# Altium schematic sheet PCA_0006_Mini_CB_80Pin_REV_B.SchDoc
size A4; DrawnBy: Philip Rowse
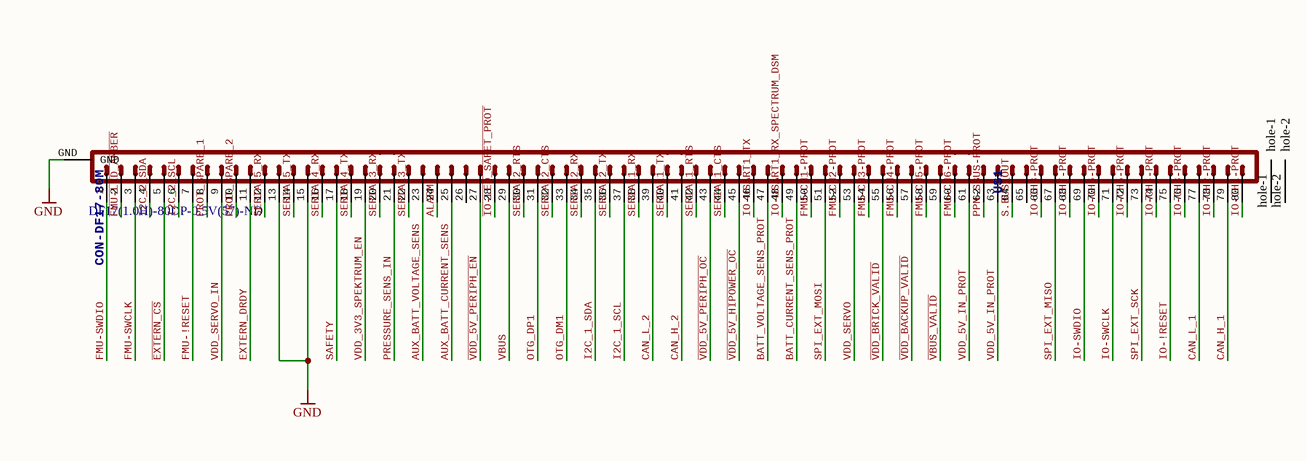
[diagram p0: PCA_0006_Mini_CB_80Pin_REV_B.SchDoc]

## Parts
U$1  CON-DF17-80M  Supplier Part Number 1: DF17(1.0H)-80DP-0.5V(57)-ND  [CON-DF17-80M]

## Nets
GND: U$1.13 U$1.15 U$1.GND
ALARM: U$1.24
AUX_BATT_CURRENT_SENS: U$1.25
AUX_BATT_VOLTAGE_SENS: U$1.23
BATT_CURRENT_SENS_PROT: U$1.49
BATT_VOLTAGE_SENS_PROT: U$1.47
CAN_H_1: U$1.79
CAN_H_2: U$1.41
CAN_L_1: U$1.77
CAN_L_2: U$1.39
~{EXTERN_CS}: U$1.5
EXTERN_DRDY: U$1.11
~{FMU-LED_AMBER}: U$1.2
FMU-!RESET: U$1.7
FMU-CH1-PROT: U$1.50
FMU-CH2-PROT: U$1.52
FMU-CH3-PROT: U$1.54
FMU-CH4-PROT: U$1.56
FMU-CH5-PROT: U$1.58
FMU-CH6-PROT: U$1.60
FMU-SWCLK: U$1.3
FMU-SWDIO: U$1.1
I2C_1_SCL: U$1.37
I2C_1_SDA: U$1.35
I2C_2_SCL: U$1.6
I2C_2_SDA: U$1.4
~{IO-LED_SAFET_PROT}: U$1.28
IO-!RESET: U$1.75
IO-CH1-PROT: U$1.80
IO-CH2-PROT: U$1.78
IO-CH3-PROT: U$1.76
IO-CH4-PROT: U$1.74
IO-CH5-PROT: U$1.72
IO-CH6-PROT: U$1.70
IO-CH7-PROT: U$1.68
IO-CH8-PROT: U$1.66
IO-SWCLK: U$1.71
IO-SWDIO: U$1.69
IO-USART1_RX_SPECTRUM_DSM: U$1.48
IO-USART1_TX: U$1.46
OTG_DM1: U$1.33
OTG_DP1: U$1.31
PPM-SBUS-PROT: U$1.62
PRESSURE_SENS_IN: U$1.21
PROT_SPARE_1: U$1.8
PROT_SPARE_2: U$1.10
S.BUS_OUT: U$1.64
SAFETY: U$1.17
SERIAL1_CTS: U$1.44
SERIAL1_RTS: U$1.42
SERIAL1_RX: U$1.38
SERIAL1_TX: U$1.40
SERIAL2_CTS: U$1.32
SERIAL2_RTS: U$1.30
SERIAL2_RX: U$1.34
SERIAL2_TX: U$1.36
SERIAL3_RX: U$1.20
SERIAL3_TX: U$1.22
SERIAL4_RX: U$1.16
SERIAL4_TX: U$1.18
SERIAL5_RX: U$1.12
SERIAL5_TX: U$1.14
SPI_EXT_MISO: U$1.67
SPI_EXT_MOSI: U$1.51
SPI_EXT_SCK: U$1.73
~{VBUS_VALID}: U$1.59
~{VDD_5V_HIPOWER_OC}: U$1.45
~{VDD_5V_PERIPH_EN}: U$1.27
~{VDD_5V_PERIPH_OC}: U$1.43
~{VDD_BACKUP_VALID}: U$1.57
~{VDD_BRICK_VALID}: U$1.55
VBUS: U$1.29
VDD_3V3_SPEKTRUM_EN: U$1.19
VDD_5V_IN_PROT: U$1.61 U$1.63
VDD_SERVO: U$1.53
VDD_SERVO_IN: U$1.9

Not connected (* = marked no-connect by the designer): U$1 26 65 hole-1 hole-2

## Notes on the sheet
- This licence Applies to this doccument ONLY, other components that make up the full system come with their own licences, please check with the Author for further information
- To the extent possible under law, Philip Rowse and 3DRobotics has waived all copyright and related or neighboring
- rights to Carrier board for APM 3.0 series. This work is published from: United States, and Australia
- Title:
- Date:
- Time:
- For information on this Licence: http://creativecommons.org/publicdomain/zero/1.0/
- Sheet:
- Approved:
- of:
- Drawn By:
- Checked By:
- 3DRobotics

## Library data of the parts
U$1 = CON-DF17-80M: Connector, Header, 80Pos, .5MM, DUAL, SMD, Au; 3DR_PARTNO: ECM0528; Supplier 1: Digi-Key